# EAGLE design AMP_OP1 (EAGLE 7.7.0)
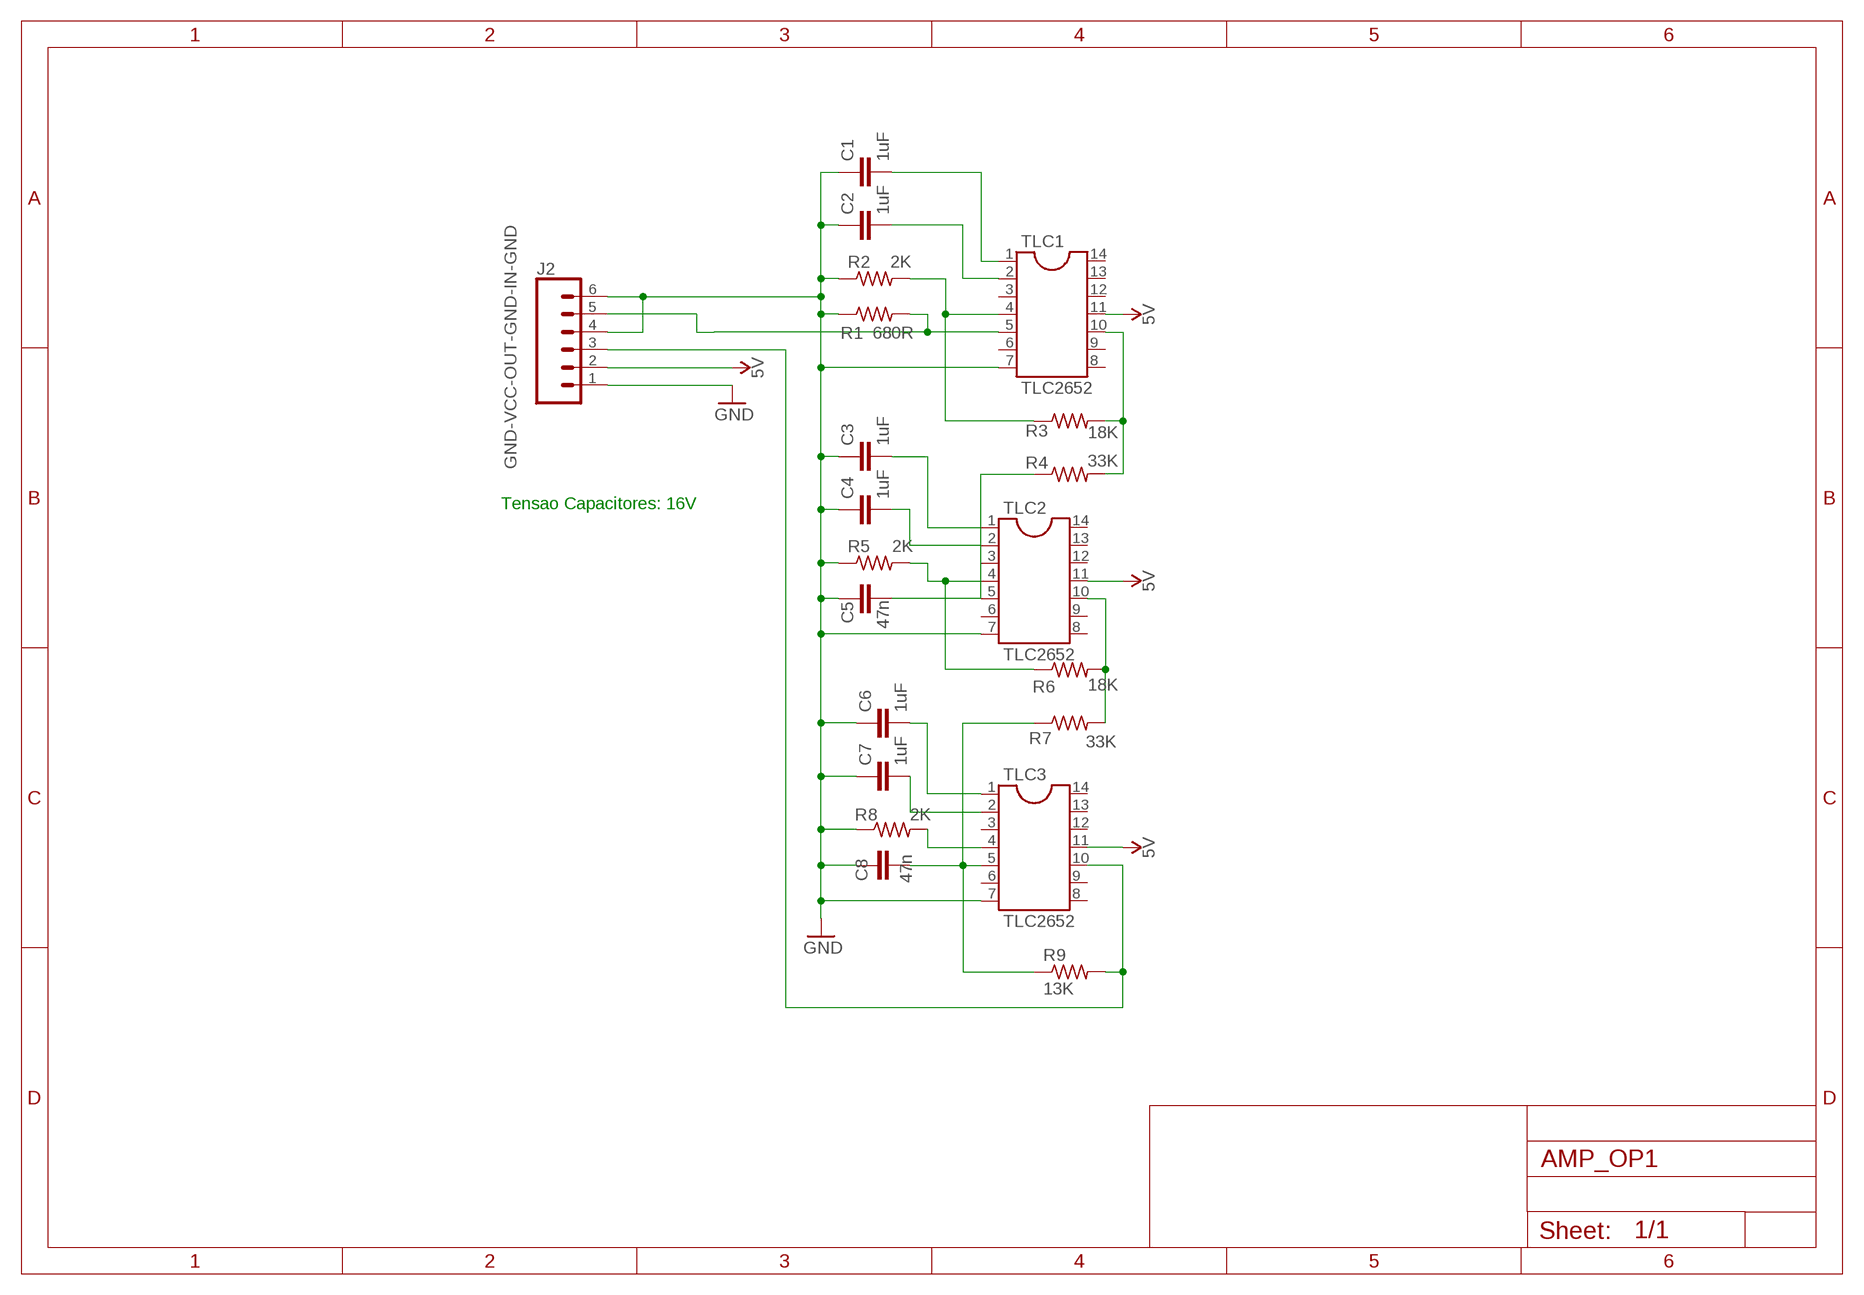
[diagram p0: schematic, sheet 1]

## Parts
C1  1uF  C5/3.5  [C5B3.5]
C2  1uF  C5/3.5  [C5B3.5]
C3  1uF  C5/3.5  [C5B3.5]
C4  1uF  C5/3.5  [C5B3.5]
C5  47n  C5/3.5  [C5B3.5]
C6  1uF  C5/3.5  [C5B3.5]
C7  1uF  C5/3.5  [C5B3.5]
C8  47n  C5/3.5  [C5B3.5]
J2  GND-VCC-OUT-GND-IN-GND  CONN_06LONGPADS  [1X06_LONGPADS]
R1  680R  R-US_0207/9  [0207/9]
R2  2K  R-US_0207/9  [0207/9]
R3  18K  R-US_0207/9  [0207/9]
R4  33K  R-US_0207/9  [0207/9]
R5  2K  R-US_0207/9  [0207/9]
R6  18K  R-US_0207/9  [0207/9]
R7  33K  R-US_0207/9  [0207/9]
R8  2K  R-US_0207/9  [0207/9]
R9  13K  R-US_0207/9  [0207/9]
TLC1  TLC2652  DIL14  [DIL14]
TLC2  TLC2652  DIL14  [DIL14]
TLC3  TLC2652  DIL14  [DIL14]

## Nets
5V: J2.2 TLC1.11 TLC2.11 TLC3.11
GND: C1.1 C2.1 C3.1 C4.1 C5.1 C6.1 C7.1 C8.1 J2.1 J2.4 J2.6 R1.1 R2.1 R5.1 R8.1 TLC1.7 TLC2.7 TLC3.7
N$1: C1.2 TLC1.1
N$2: C2.2 TLC1.2
N$3: C3.2 TLC2.1
N$4: C4.2 TLC2.2
N$5: C7.2 TLC3.2
N$6: R2.2 R3.1 TLC1.4
N$7: C6.2 TLC3.1
N$9: J2.5 R1.2 TLC1.5
N$11: R3.2 R4.2 TLC1.10
N$12: C5.2 R4.1 TLC2.3 TLC2.5
N$14: R5.2 R6.1 TLC2.4
N$15: R8.2 TLC3.4
N$16: C8.2 R7.1 R9.1 TLC3.5
N$18: R6.2 R7.2 TLC2.10
N$19: J2.3 R9.2 TLC3.10
Unconnected: TLC1.3 TLC1.6 TLC1.8 TLC1.9 TLC1.12 TLC1.13 TLC1.14 TLC2.6 TLC2.8 TLC2.9 TLC2.12 TLC2.13 TLC2.14 TLC3.3 TLC3.6 TLC3.8 TLC3.9 TLC3.12 TLC3.13 TLC3.14

## Notes on the sheet
- Tensao Capacitores: 16V

## Library data of the parts
C1-C8 = capacitor-wima:C: CAPACITOR naming: grid - package width
J2 = SparkFun-Connectors:CONN_06: Multi connection point. Often used as Generic Header-pin footprint for 0.1 inch spaced/style header connections On any of the 0.1 inch spaced packages, you can populate with these: Break Away Headers - Straight <https://www.sparkfun.com/products/116> (PRT-00116) Break Away Male Headers - Right Angle <https://www.sparkfun.com/products/553> (PRT-00553) Female Headers <https://www.sparkfun.com/products/115> (PRT-00115) Break Away Headers - Machine Pin <https://www.sparkfun.com/products/117> (PRT-00117) Break Away Female Headers - Swiss Machine Pin <https://www.sparkfun.com/products/743> (PRT-00743) Arduino Stackable Header - 6 Pin <https://www.sparkfun.com/products/9280> (PRT-09280) For SCREWTERMINALS and SPRING TERMINALS visit here: Screw Terimnals on SparkFun.com <https://www.sparkfun.com/search/results?term=Screw+Terminals> (5mm/3.5mm/2.54mm spacing) This device is also useful as a general connection point to wire up your design to another part of your project. Our various solder wires solder well into these plated through hole pads. Hook-Up Wire - Assortment (Stranded, 22 AWG) <https://www.sparkfun.com/products/11375> (PRT-11375) Hook-Up Wire - Assortment (Solid Core, 22 AWG) <https://www.sparkfun.com/products/11367> (PRT-11367) View the entire wire category on our website here <https://www.sparkfun.com/categories/141>
R1-R9 = adafruit:R-US_: RESISTOR, American symbol
TLC1-TLC3 = ic-package:DIL14: Dual In Line / Socket

## Board
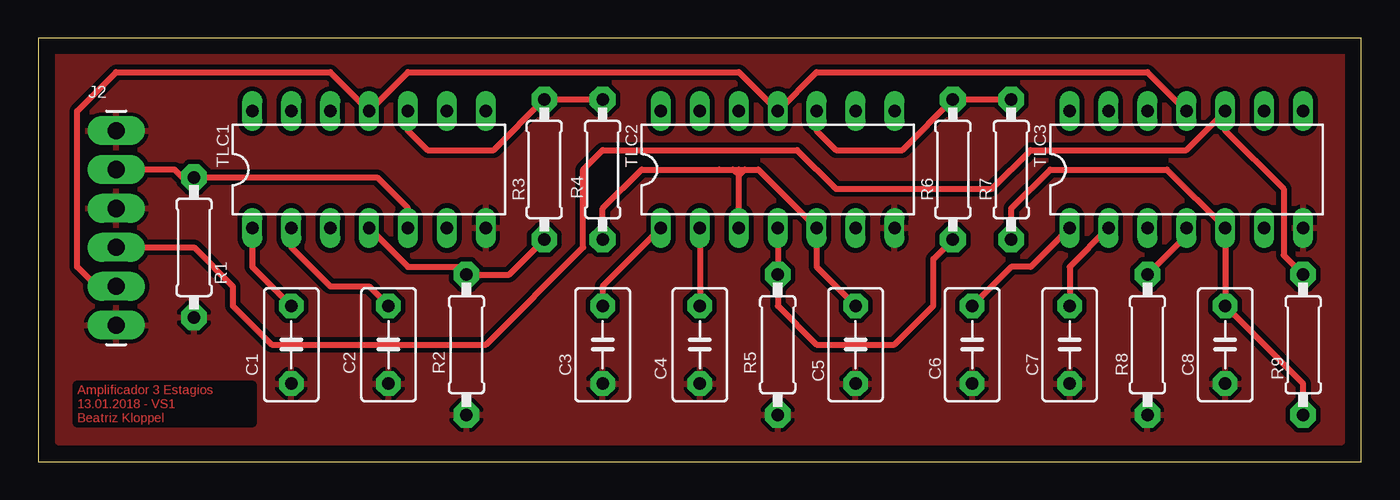
[diagram p1: board, top side]
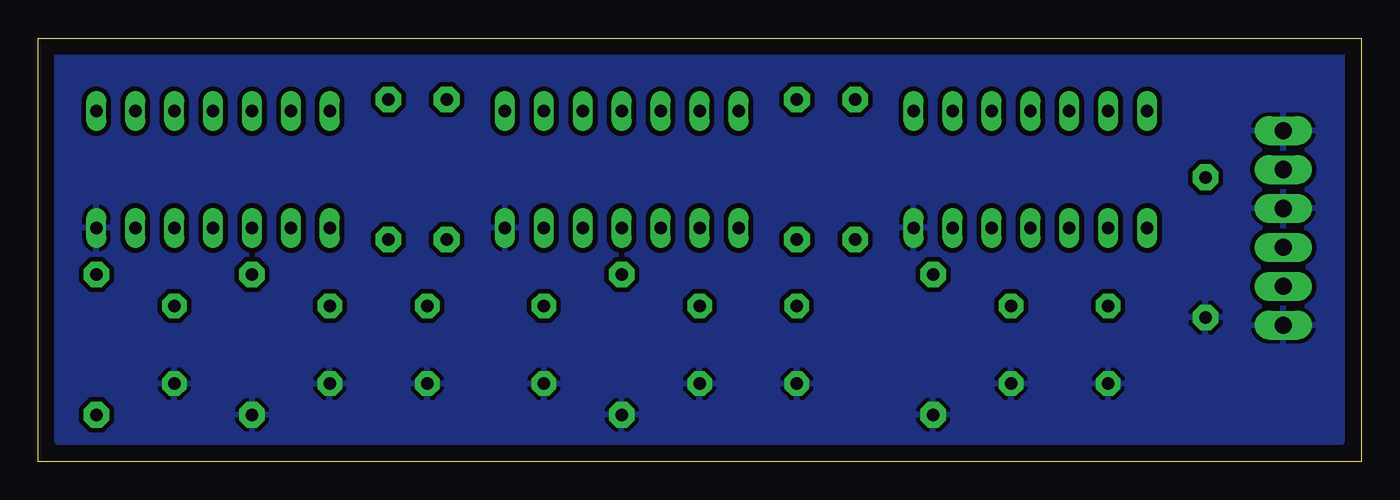
[diagram p2: board, bottom side, seen from below]

Size 86.34 x 27.61 mm. Coordinates in mm from the lower left corner, seen from the top.
Outline: 0,0 86.34,0 86.34,27.61 0,27.61 0,0
Copper layers (1*16): Top 0.035mm / dielectric 1.5mm / Bottom 0.035mm
Design rules "default": minimum track width 10mil, minimum drill 24mil, track to track 8mil, track to pad 8mil, pad to pad 8mil, via to via 8mil, smd to smd 8mil, copper to edge 40mil, drill to drill 8mil, minimum pad ring 10mil, minimum via ring 8mil, stop-mask expansion 4mil, vias tented up to drill 0mil, thermal gap 10mil

### Footprints (pad centres in the part's own frame; a part is rotated, then mirrored left to right if it is on the bottom)
C5B3.5 = drill 0.813 pad 1.6 octagon: 1 -2.54,0; 2 2.54,0
1X06_LONGPADS = drill 1.118 pad 1.88 long: 1 0,0; 2 2.54,0; 3 5.08,0; 4 7.62,0; 5 10.16,0; 6 12.7,0
0207/9 = drill 0.813 pad 1.676 octagon: 1 -4.572,0; 2 4.572,0
DIL14 = drill 0.813 long: 1 -7.62,-3.81; 2 -5.08,-3.81; 3 -2.54,-3.81; 4 0,-3.81; 5 2.54,-3.81; 6 5.08,-3.81; 7 7.62,-3.81; 8 7.62,3.81; 9 5.08,3.81; 10 2.54,3.81; 11 0,3.81; 12 -2.54,3.81; 13 -5.08,3.81; 14 -7.62,3.81

### Placement (x,y rotation side)
C1  16.51,7.62 90 top
C2  22.86,7.62 90 top
C3  36.83,7.62 90 top
C4  43.18,7.62 90 top
C5  53.34,7.62 90 top
C6  60.96,7.62 90 top
C7  67.31,7.62 90 top
C8  77.47,7.62 90 top
J2  5.08,8.89 90 top
R1  10.16,13.97 90 top
R2  27.94,7.62 90 top
R3  33.02,19.05 90 top
R4  36.83,19.05 90 top
R5  48.26,7.62 90 top
R6  59.69,19.05 90 top
R7  63.5,19.05 90 top
R8  72.39,7.62 90 top
R9  82.55,7.62 90 top
TLC1  21.59,19.05 0 top
TLC2  48.26,19.05 0 top
TLC3  74.93,19.05 0 top

### Tracks (layer width: path | path; a pad name or v marks a point on that pad's centre or on a via)
5V
  Top 0.406: TLC3.11 72.39,25.4 50.8,25.4 TLC2.11 45.72,25.4 24.13,25.4 TLC1.11 19.05,25.4 5.08,25.4 2.54,22.86 2.54,12.7 3.81,11.43 J2.2
GND
  pour Top (isolate 0.305): 1.27,26.67 1.27,1.27 85.09,1.27 85.09,26.67
  pour Bottom (isolate 0.305): 1.27,26.67 1.27,1.27 85.09,1.27 85.09,26.67
N$1
  Top 0.406: TLC1.1 13.97,12.7 C1.2
N$2
  Top 0.406: TLC1.2 16.51,13.97 19.05,11.43 21.59,11.43 C2.2
N$3
  Top 0.406: TLC2.1 36.83,11.43 C3.2
N$4
  Top 0.406: TLC2.2 C4.2
N$5
  Top 0.406: TLC3.2 67.31,12.7 C7.2
N$6
  Top 0.406: TLC1.4 24.13,12.7 27.43,12.7 R2.2 30.73,12.19 R3.1
N$7
  Top 0.406: TLC3.1 64.77,12.7 63.5,12.7 C6.2
N$9
  Top 0.406: TLC1.5 24.13,16.51 22.1,18.54 R1.2 9.4,18.54 8.89,19.05 J2.5
N$11
  Top 0.406: TLC1.10 24.13,21.59 25.4,20.32 29.72,20.32 R3.2 R4.2
N$12
  Top 0.406: C5.2 50.8,12.7 TLC2.5 46.99,19.05 46.1,19.05 | R4.1 36.83,16.51 39.37,19.05 44.45,19.05 | 44.45,19.05 45.72,19.05 | 45.72,19.05 46.1,19.05 | TLC2.3 45.72,17.78 | 45.72,17.78 45.72,18.67 | 45.72,18.67 45.72,19.05 | 44.45,19.05 45.34,19.05 45.72,18.67 | 45.72,17.78 45.72,18.67 | 45.72,18.67 46.1,19.05
N$14
  Top 0.406: TLC2.4 R5.2 48.26,10.16 50.8,7.62 55.88,7.62 58.42,10.16 58.42,13.21 R6.1
N$15
  Top 0.406: TLC3.4 74.93,14.73 R8.2
N$16
  Top 0.406: R7.1 63.5,16.51 66.04,19.05 73.66,19.05 TLC3.5 C8.2 82.55,5.08 R9.1
N$18
  Top 0.406: TLC2.10 50.8,21.59 52.07,20.32 56.39,20.32 R6.2 R7.2
N$19
  Top 0.406: R9.2 81.28,13.46 81.28,17.78 77.47,21.59 TLC3.10 74.93,20.32 64.77,20.32 62.23,17.78 52.07,17.78 49.53,20.32 36.83,20.32 35.56,19.05 35.56,13.97 29.21,7.62 15.24,7.62 12.7,10.16 12.7,11.43 10.16,13.97 J2.3

### Text on the board
Top: Amplificador 3 Estagios / 13.01.2018 - VS1 / Beatriz Kloppel
tValues: GND | IN | GND | OUT | VCC | GND